# EAGLE design CCM_0003 (EAGLE 6.5.0)
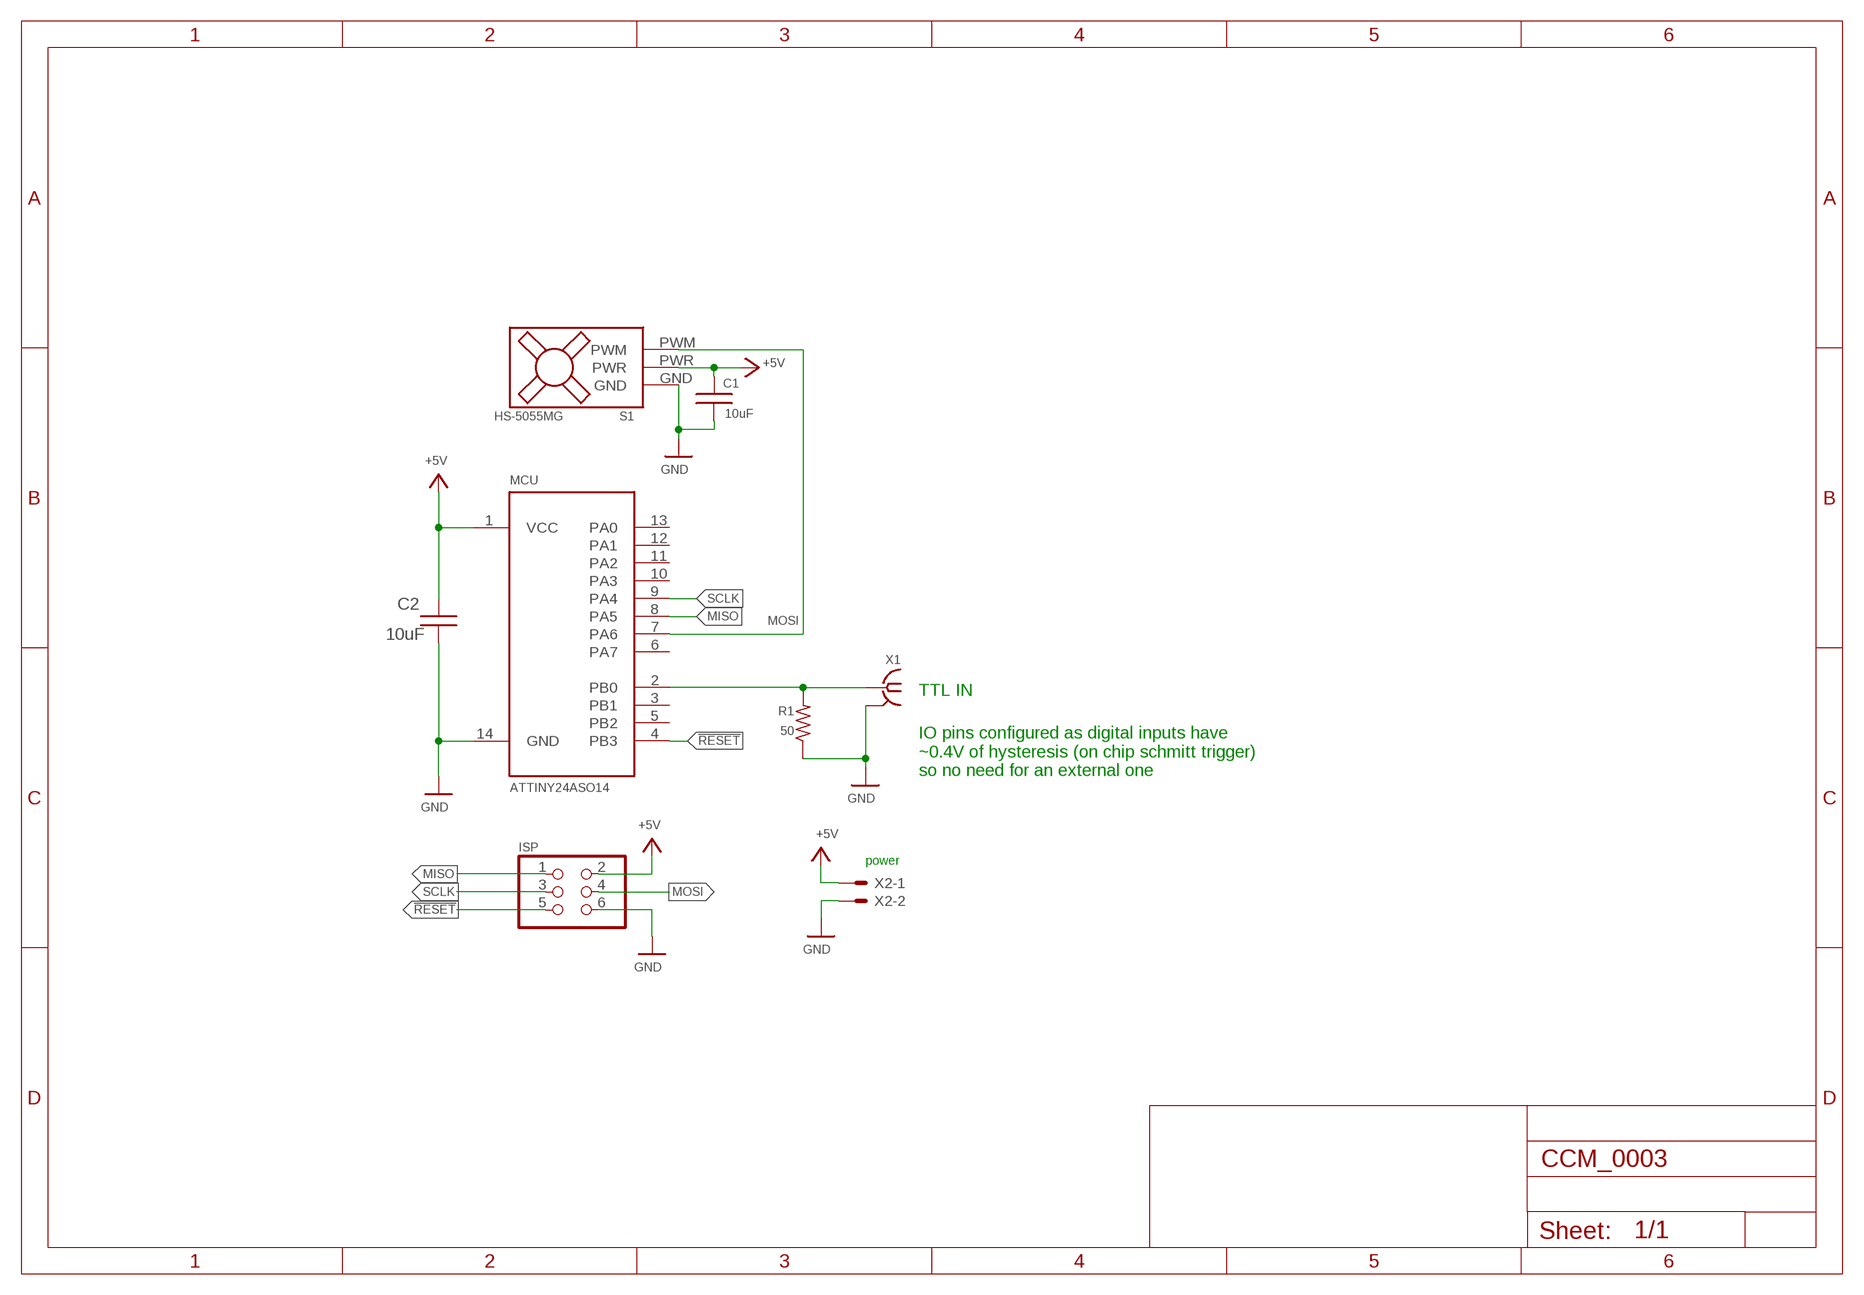
[diagram p0: schematic, sheet 1]

## Parts
C1  10uF  CAPACITOR0603  [0603]
C2  10uF  CAPACITOR0603  [0603]
ISP  ISP  PINHD-2X3  [2X03]
MCU  ATTINY24ASO14  [SO14]
R1  50  R-US_R2010  [R2010]
S1  HS-5055MG  [HS-5055MG]
X1  BU-SMA-H  [BU-SMA-H]
X2  22-23-2021  [22-23-2021]

## Nets
!RESET: ISP.5 MCU.4(PB3)
+5V: C1.1 C2.1 ISP.2 MCU.1(VCC) S1.PWR X2.1
GND: C1.2 C2.2 ISP.6 MCU.14(GND) R1.1 S1.GND X1.2 X1.3 X1.4 X1.5 X2.2
MISO: ISP.1 MCU.8(PA5)
MOSI: ISP.4 MCU.7(PA6) S1.PWM
SCLK: ISP.3 MCU.9(PA4)
TTL: MCU.2(PB0) R1.2 X1.1
Unconnected: MCU.3(PB1) MCU.5(PB2) MCU.6(PA7) MCU.10(PA3) MCU.11(PA2) MCU.12(PA1) MCU.13(PA0)

## Notes on the sheet
- TTL IN
- IO pins configured as digital inputs have 
  ~0.4V of hysteresis (on chip schmitt trigger)
  so no need for an external one
- power

## Library data of the parts
C1 C2 = ic:CAPACITOR
ISP = pinhead:PINHD-2X3: PIN HEADER
MCU = custom_parts:ATTINY24A
R1 = resistor:R-US_: RESISTOR, American symbol
S1 = ic:HS-5055MG
X1 = con-coax:BU-SMA-H: FEMALE SMA CONNECTOR Radiall; OC_FARNELL: unknown; OC_NEWARK: unknown
X2 = con-molex:22-23-2021: .100" (2.54mm) Center Header - 2 Pin; MF: MOLEX; MPN: 22-23-2021; OC_FARNELL: 1462926; OC_NEWARK: 25C3832

## Board
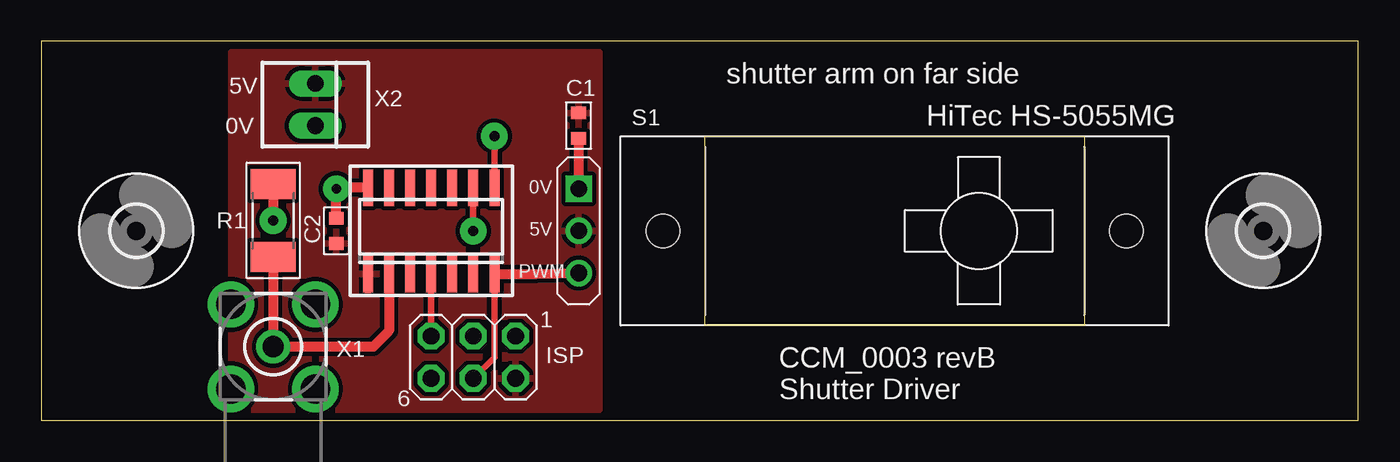
[diagram p1: board, top side]
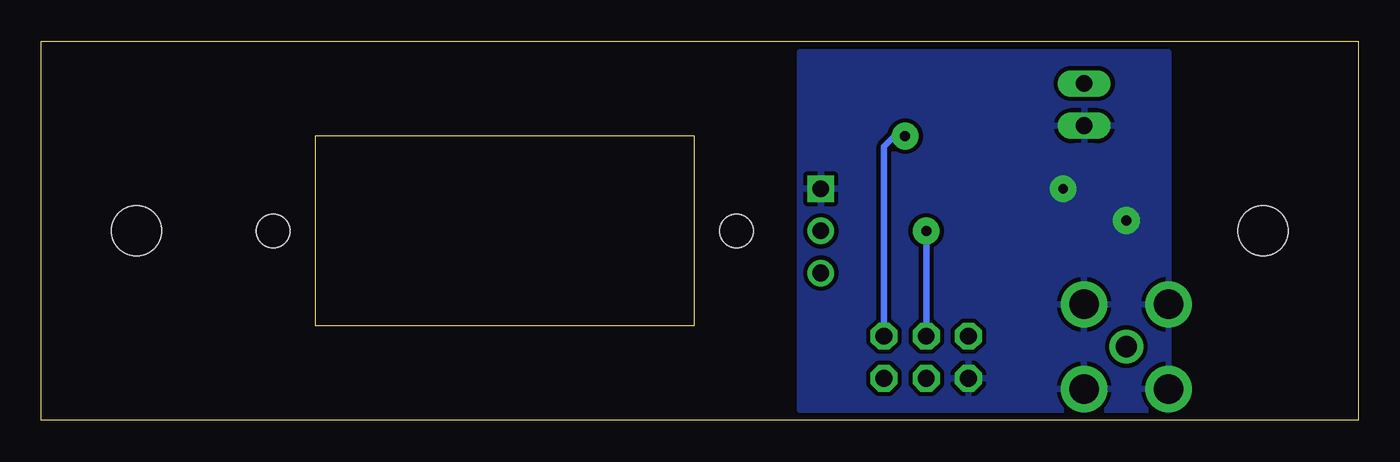
[diagram p2: board, bottom side, seen from below]

Size 79.38 x 22.86 mm. Coordinates in mm from the lower left corner, seen from the top.
Outline: 0,0 79.38,0 79.38,22.86 0,22.86 0,0
Copper layers (1*16): Top 0.035mm / dielectric 1.5mm / Bottom 0.035mm
Design rules "default *": minimum track width 15mil, minimum drill 0.6mm, track to track 10mil, track to pad 10mil, pad to pad 10mil, via to via 10mil, smd to smd 10mil, copper to edge 0mil, drill to drill 8mil, minimum pad ring 10mil, minimum via ring 20mil, stop-mask expansion 4mil, vias tented up to drill 0mil, thermal gap 10mil

### Footprints (pad centres in the part's own frame; a part is rotated, then mirrored left to right if it is on the bottom)
0603 = smd 0.762 x 0.889: 1 -0.762,0; 2 0.762,0
2X03 = drill 1.016 octagon: 1 -2.54,-1.27; 2 -2.54,1.27; 3 0,-1.27; 4 0,1.27; 5 2.54,-1.27; 6 2.54,1.27
SO14 = smd 0.6 x 2.2: 1 -3.81,-2.6; 2 -2.54,-2.6; 3 -1.27,-2.6; 4 0,-2.6; 5 1.27,-2.6; 6 2.54,-2.6; 7 3.81,-2.6; 8 3.81,2.6; 9 2.54,2.6; 10 1.27,2.6; 11 0,2.6; 12 -1.27,2.6; 13 -2.54,2.6; 14 -3.81,2.6
R2010 = smd 1.8 x 2.7: 1 -2.2,0; 2 2.2,0
HS-5055MG = drill 1 square: GND -19.05,2.54 | drill 1: PWM -19.05,-2.54; PWR -19.05,0 | hole 2: -13.97,0; 13.97,0
3,0 = hole 3: 0,0
BU-SMA-H = drill 1.27: 1 0,0 | drill 1.778: 2 -2.55,2.55; 3 2.55,2.55; 4 2.55,-2.55; 5 -2.55,-2.55
22-23-2021 = drill 1 long: 1 -1.27,0; 2 1.27,0

### Placement (x,y rotation side)
C1  32.38,17.78 270 top
C2  17.78,11.43 90 top
ISP  26.04,3.81 180 top
MCU  23.5,11.43 0 top
R1  13.97,12.06 270 top
S1  51.44,11.43 0 top
U$1  [3,0]  5.71,11.43 0 top
U$3  [3,0]  73.66,11.43 0 top
X1  13.97,4.45 270 top
X2  16.51,19.05 270 top

### Tracks (layer width: path | path; a pad name or v marks a point on that pad's centre or on a via)
!RESET
  Top 0.406: ISP.5 MCU.4
+5V
  pour Top: 11.43,22.23 33.66,22.23 33.66,0.64 11.43,0.64
GND  (via drill 0.6, 0.6 pad 0.61)
  Top 0.61: R1.1 v13.97,12.06 | MCU.14 18.48,14.03 v17.78,13.97 C2.2 | C1.2 S1.GND
  pour Bottom: 11.43,22.23 33.66,22.23 33.66,0.64 11.43,0.64
MISO  (via drill 0.6)
  Top 0.406: v27.3,17.14 MCU.8
  Bottom 0.406: ISP.1 28.57,16.51 27.94,17.14 v27.3,17.14
MOSI
  Top 0.406: ISP.4 27.3,3.81 MCU.7
  Top 0.61: MCU.7 29.79,8.83 S1.PWM
SCLK  (via drill 0.6)
  Top 0.406: v26.04,11.43 MCU.9
  Bottom 0.406: ISP.3 v26.04,11.43
TTL
  Top 0.61: MCU.2 20.95,5.4 20,4.45 X1.1 R1.2

### Text on the board
tPlace: 5V | shutter arm on far side | 0V | 0V | 5V | PWM | 1 | 6 | CCM_0003 revB / Shutter Driver